# Altium schematic sheet VoltageRef.SchDoc
size A3; Author: P Shersby; SheetNumber: 1
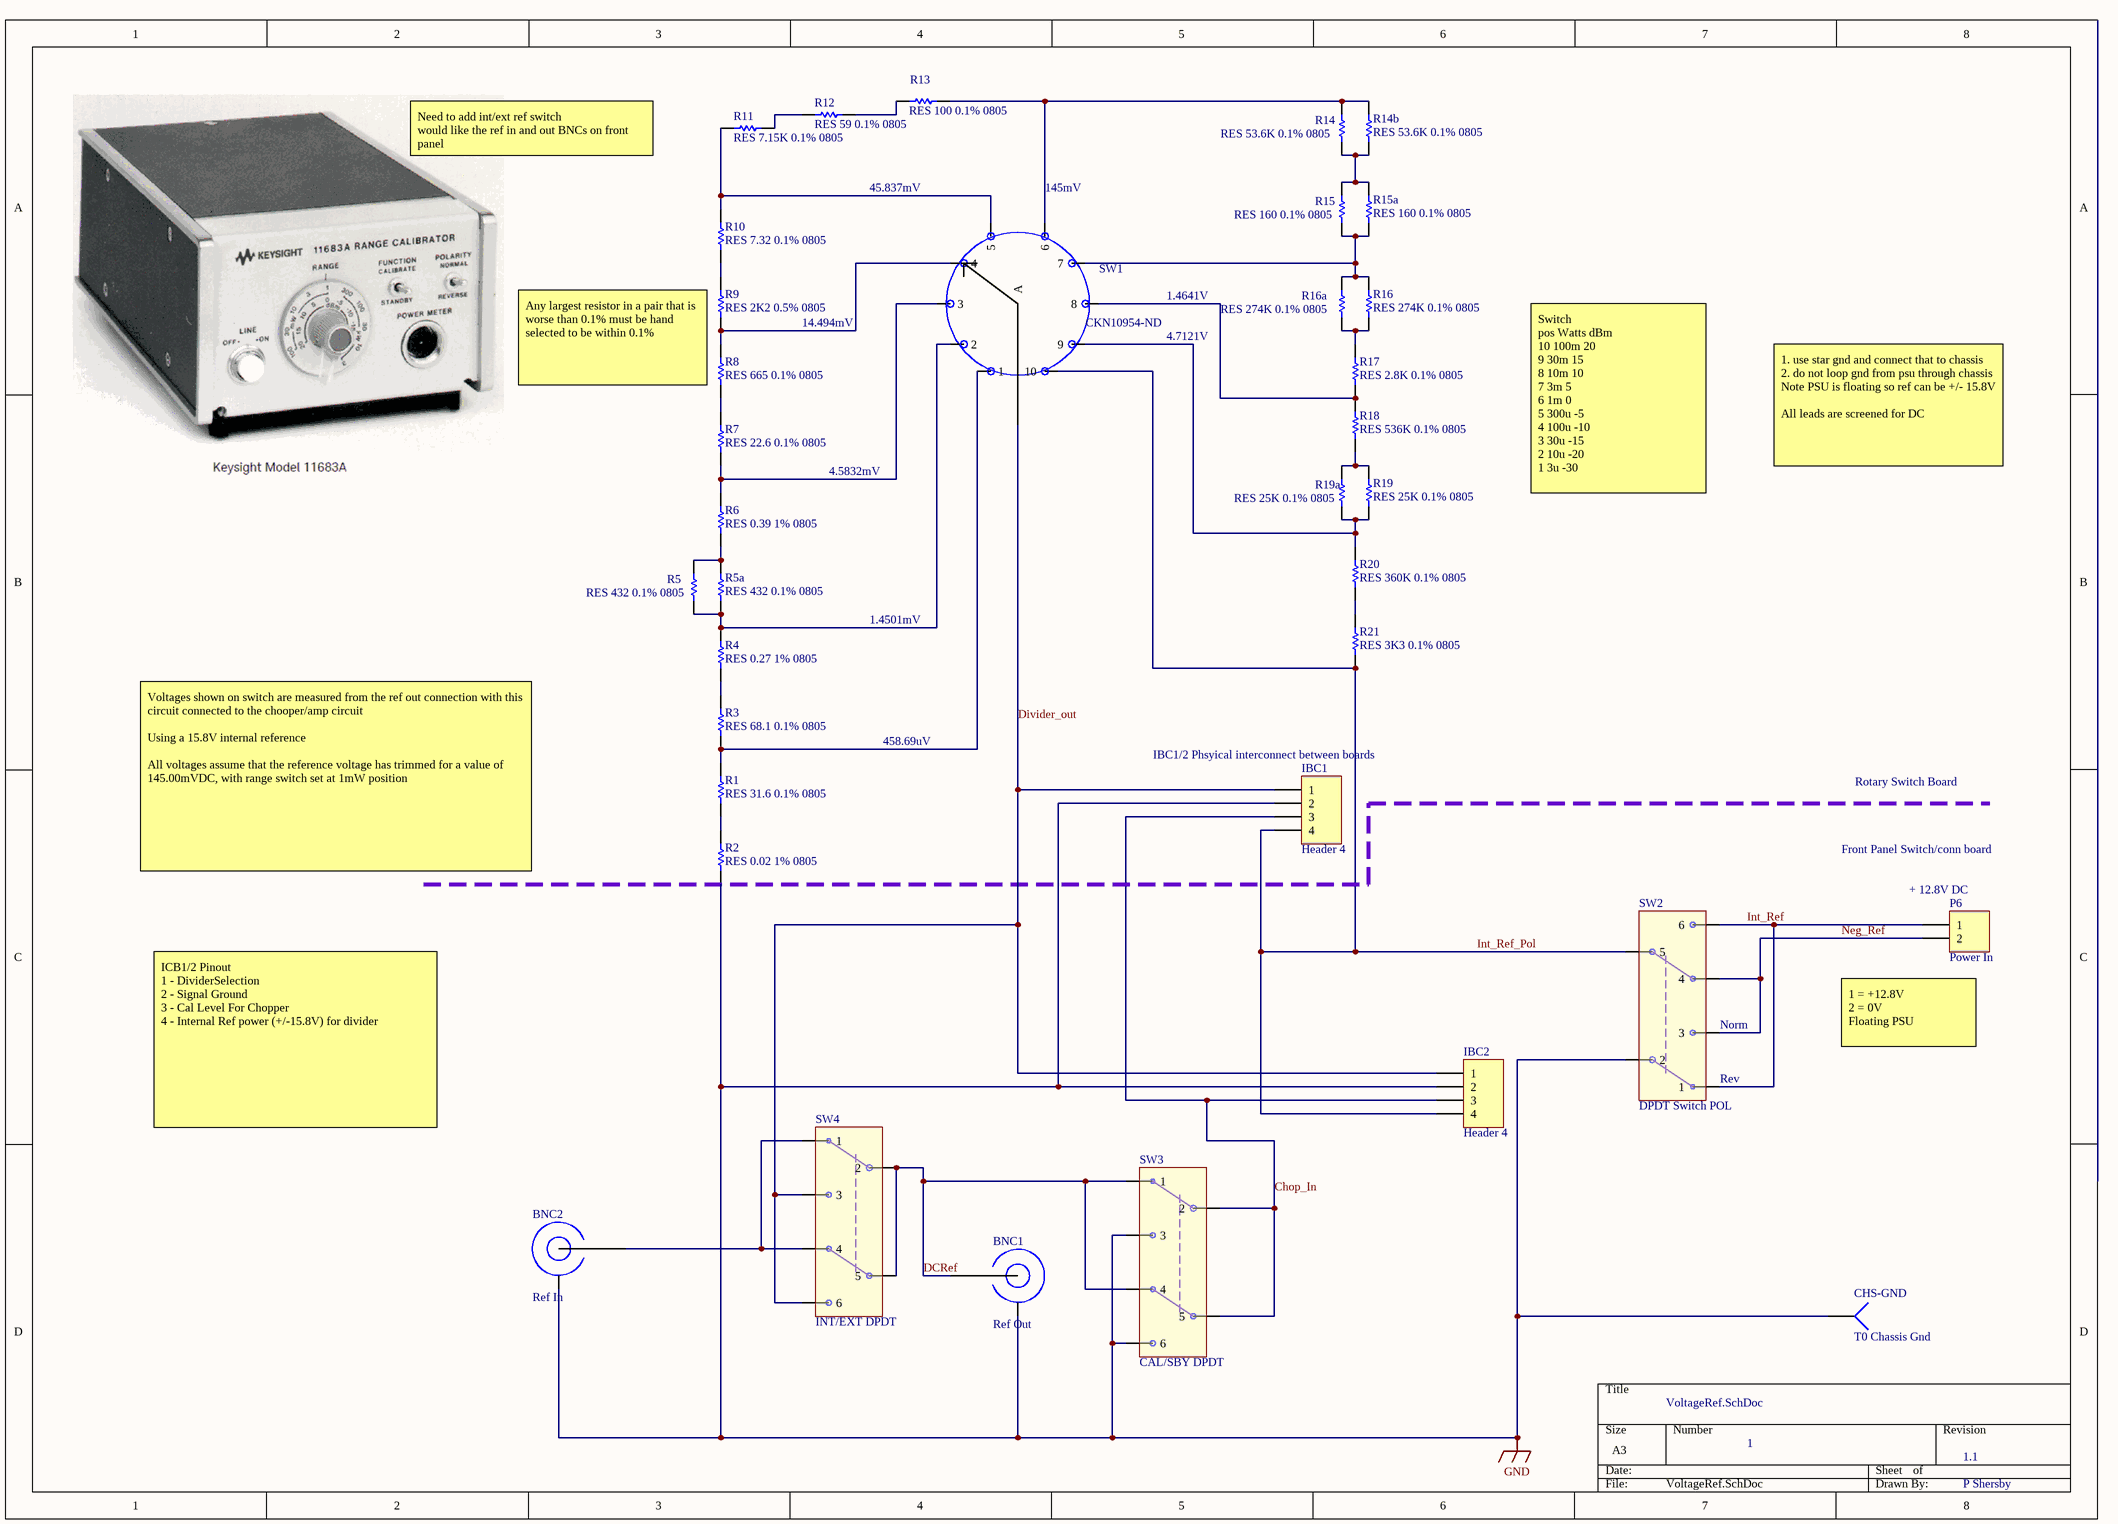
[diagram p0: VoltageRef.SchDoc]

## Parts
BNC1  Ref Out  [BNC PCB Plastic]
BNC2  Ref In  [BNC PCB Plastic]
CHS-GND  T0 Chassis Gnd  [PIN1]
IBC1  Header 4  [HDR1X4]
IBC2  Header 4  [HDR1X4]
P6  Power In  [HDR1X2]
R1  RES 31.6 0.1% 0805  [RESC2013X70X40LL20T20]
R2  RES 0.02 1% 0805  [RESC2013X70X40LL20T20]
R3  RES 68.1 0.1% 0805  [RESC2013X70X40LL20T20]
R4  RES 0.27 1% 0805  [RESC2013X70X40LL20T20]
R5  RES 432 0.1% 0805  [RESC2013X70X40LL20T20]
R5a  RES 432 0.1% 0805  [RESC2013X70X40LL20T20]
R6  RES 0.39 1% 0805  [RESC2013X70X40LL20T20]
R7  RES 22.6 0.1% 0805  [RESC2013X70X40LL20T20]
R8  RES 665 0.1% 0805  [RESC2013X70X40LL20T20]
R9  RES 2K2 0.5% 0805  [RESC2013X70X40LL20T20]
R10  RES 7.32 0.1% 0805  [RESC2013X70X40LL20T20]
R11  RES 7.15K 0.1% 0805  [RESC2013X70X40LL20T20]
R12  RES 59 0.1% 0805  [RESC2013X70X40LL20T20]
R13  RES 100 0.1% 0805  [RESC2013X70X40LL20T20]
R14  RES 53.6K 0.1% 0805  [RESC2013X70X40LL20T20]
R14b  RES 53.6K 0.1% 0805  [RESC2013X70X40LL20T20]
R15  RES 160 0.1% 0805  [RESC2013X70X40LL20T20]
R15a  RES 160 0.1% 0805  [RESC2013X70X40LL20T20]
R16  RES 274K 0.1% 0805  [RESC2013X70X40LL20T20]
R16a  RES 274K 0.1% 0805  [RESC2013X70X40LL20T20]
R17  RES 2.8K 0.1% 0805  [RESC2013X70X40LL20T20]
R18  RES 536K 0.1% 0805  [RESC2013X70X40LL20T20]
R19  RES 25K 0.1% 0805  [RESC2013X70X40LL20T20]
R19a  RES 25K 0.1% 0805  [RESC2013X70X40LL20T20]
R20  RES 360K 0.1% 0805  [RESC2013X70X40LL20T20]
R21  RES 3K3 0.1% 0805  [RESC2013X70X40LL20T20]
SW1  Part Number: CKN10954-ND  [SW_ROT_4x12]  (hidden comment: Rotary Switch 10way)
SW2  DPDT Switch POL  [DPDT Toggle E switch]
SW3  CAL/SBY DPDT  [DPDT Toggle E switch]
SW4  INT/EXT DPDT  [DPDT Toggle E switch]

## Nets
GND: BNC1.2(Gnd) BNC2.2(Gnd) CHS-GND.1 IBC1.2 IBC2.2 R2.1 SW2.2 SW3.3 SW3.6
Chop_In: IBC1.3 IBC2.3 SW3.2 SW3.5
DCRef: BNC1.1(Signal) SW3.1 SW3.4 SW4.2 SW4.5
Divider_out: IBC1.1 IBC2.1 SW1.A SW4.3 SW4.6
Int_Ref: P6.1 SW2.1 SW2.6
Int_Ref_Pol: IBC1.4 IBC2.4 R21.1 SW1.10 SW2.5
Neg_Ref: P6.2 SW2.3 SW2.4
NetBNC2_1: BNC2.1(Signal) SW4.1 SW4.4
NetR1_1: R1.1 R2.2
NetR1_2: R1.2 R3.1 SW1.1
NetR3_2: R3.2 R4.1
NetR4_2: R4.2 R5.1 R5a.1 SW1.2
NetR5_2: R5.2 R5a.2 R6.1
NetR6_2: R6.2 R7.1 SW1.3
NetR7_2: R7.2 R8.1
NetR8_2: R8.2 R9.1 SW1.4
NetR9_2: R9.2 R10.1
NetR10_2: R10.2 R11.1 SW1.5
NetR11_2: R11.2 R12.1
NetR12_2: R12.2 R13.1
NetR13_2: R13.2 R14.2 R14b.2 SW1.6
NetR14_1: R14.1 R14b.1 R15.2 R15a.2
NetR15_1: R15.1 R15a.1 R16.2 R16a.2 SW1.7
NetR16_1: R16.1 R16a.1 R17.2
NetR17_1: R17.1 R18.2 SW1.8
NetR18_1: R18.1 R19.2 R19a.2
NetR19_1: R19.1 R19a.1 R20.2 SW1.9
NetR20_1: R20.1 R21.2

## Notes on the sheet
- Need to add int/ext ref switch
  would like the ref in and out BNCs on front panel
- 45.837mV
- (near SW1) 145mV
- 14.494mV
- 1.4641V
- Any largest resistor in a pair that is worse than 0.1% must be hand selected to be within 0.1%
- 4.7121V
- 1. use star gnd and connect that to chassis
  2. do not loop gnd from psu through chassis
  Note PSU is floating so ref can be +/- 15.8V
  All leads are screened for DC
- 4.5832mV
- Switch
  pos	Watts	dBm
  10	100m	20
  9	30m	15
  8	10m	10
  7	3m	5
  6	1m	0
  5	300u	-5
  4	100u	-10
  3	30u	-15
  2	10u	-20
  1	3u	-30
- 1.4501mV
- 458.69uV
- (near IBC1) IBC1/2 Phsyical interconnect between boards
- Rotary Switch Board
- Voltages shown on switch are measured from the ref out connection with this circuit connected to the chooper/amp circuit
  Using a 15.8V internal reference
  All voltages assume that the reference voltage has trimmed for a value of 145.00mVDC, with range switch set at 1mW position
- Front Panel Switch/conn board
- (near P6) + 12.8V DC
- (near SW2) Norm
- (near P6) 1 = +12.8V
  2 = 0V
  Floating PSU
- ICB1/2 Pinout
  1 - DividerSelection
  2 - Signal Ground
  3 - Cal Level For Chopper
  4 - Internal Ref power (+/-15.8V) for divider
- (near SW2) Rev
- 1.1

## Library data of the parts
BNC1 = BNC PCB: BNC PCB Mount
BNC2 = BNC PCB: BNC Ref Out
CHS-GND = Socket: LatestRevisionDate: 17-Jul-2002; LatestRevisionNote: Re-released for DXP Platform.; Publisher: Altium Limited
IBC1 IBC2 = Header 4: Header, 4-Pin; LatestRevisionDate: 17-Jul-2002; LatestRevisionNote: Re-released for DXP Platform.; Publisher: Altium Limited
P6 = Header 2: Header, 2-Pin; LatestRevisionDate: 17-Jul-2002; LatestRevisionNote: Re-released for DXP Platform.; Publisher: Altium Limited
R1 = CMP-2001-00110-5: Resistor 31.6 0.1% 0805  0.2W 10ppm/C; Manufacturer: Panasonic; Voltage Rating: 150 V; Package Quantity: 5000; PackageDescription: 2-Pin Surface Mount Device, Body 2 x 1.25 mm; Mounting Technology: Surface Mount; ComponentLink2URL: http://industrial.panasonic.com/cdbs/www-data/pdf/RDA0000/AOA0000C86.pdf; DatasheetVersion: 04/2015; ComponentLink1URL: http://www.panasonic.com/; Mount: Surface Mount; ComponentLink1Description: Manufacturer URL; RoHSCompliant: true; PackageReference: 0805; Min Operating Temperature: -55 degC; Height: 0.6 mm; ComponentLink2Description: Datasheet; Max Operating Temperature: 155 degC; Length: 2 mm; Packaging: Tape and Reel; REACH SVHC: Yes
R2 = CMP-2001-00110-5: Resistor 0.02 1% 0805  0.5W 50ppm/C; Manufacturer: Panasonic; Voltage Rating: 150 V; Package Quantity: 5000; PackageDescription: 2-Pin Surface Mount Device, Body 2 x 1.25 mm; Mounting Technology: Surface Mount; ComponentLink2URL: http://industrial.panasonic.com/cdbs/www-data/pdf/RDA0000/AOA0000C86.pdf; DatasheetVersion: 04/2015; ComponentLink1URL: http://www.panasonic.com/; Mount: Surface Mount; ComponentLink1Description: Manufacturer URL; RoHSCompliant: true; PackageReference: 0805; Min Operating Temperature: -55 degC; Height: 0.6 mm; ComponentLink2Description: Datasheet; Max Operating Temperature: 155 degC; Length: 2 mm; Packaging: Tape and Reel; REACH SVHC: Yes
R3 = CMP-2001-00110-5: Resistor 68.1 0.1% 0805  0.2W 10ppm/C; Manufacturer: Panasonic; Voltage Rating: 150 V; Package Quantity: 5000; PackageDescription: 2-Pin Surface Mount Device, Body 2 x 1.25 mm; Mounting Technology: Surface Mount; ComponentLink2URL: http://industrial.panasonic.com/cdbs/www-data/pdf/RDA0000/AOA0000C86.pdf; DatasheetVersion: 04/2015; ComponentLink1URL: http://www.panasonic.com/; Mount: Surface Mount; ComponentLink1Description: Manufacturer URL; RoHSCompliant: true; PackageReference: 0805; Min Operating Temperature: -55 degC; Height: 0.6 mm; ComponentLink2Description: Datasheet; Max Operating Temperature: 155 degC; Length: 2 mm; Packaging: Tape and Reel; REACH SVHC: Yes
R4 = CMP-2001-00110-5: Resistor 0.27 1% 0805  0.2W 10ppm/C; Manufacturer: Panasonic; Voltage Rating: 150 V; Package Quantity: 5000; PackageDescription: 2-Pin Surface Mount Device, Body 2 x 1.25 mm; Mounting Technology: Surface Mount; ComponentLink2URL: http://industrial.panasonic.com/cdbs/www-data/pdf/RDA0000/AOA0000C86.pdf; DatasheetVersion: 04/2015; ComponentLink1URL: http://www.panasonic.com/; Mount: Surface Mount; ComponentLink1Description: Manufacturer URL; RoHSCompliant: true; PackageReference: 0805; Min Operating Temperature: -55 degC; Height: 0.6 mm; ComponentLink2Description: Datasheet; Max Operating Temperature: 155 degC; Length: 2 mm; Packaging: Tape and Reel; REACH SVHC: Yes
R5 R5a = CMP-2001-00110-5: Resistor 432 0.1% 0805  0.2W 10ppm/C; Manufacturer: Panasonic; Voltage Rating: 150 V; Package Quantity: 5000; PackageDescription: 2-Pin Surface Mount Device, Body 2 x 1.25 mm; Mounting Technology: Surface Mount; ComponentLink2URL: http://industrial.panasonic.com/cdbs/www-data/pdf/RDA0000/AOA0000C86.pdf; DatasheetVersion: 04/2015; ComponentLink1URL: http://www.panasonic.com/; Mount: Surface Mount; ComponentLink1Description: Manufacturer URL; RoHSCompliant: true; PackageReference: 0805; Min Operating Temperature: -55 degC; Height: 0.6 mm; ComponentLink2Description: Datasheet; Max Operating Temperature: 155 degC; Length: 2 mm; Packaging: Tape and Reel; REACH SVHC: Yes
R6 = CMP-2001-00110-5: Resistor 0.39 1% 0805  0.2W 10ppm/C; Manufacturer: Panasonic; Voltage Rating: 150 V; Package Quantity: 5000; PackageDescription: 2-Pin Surface Mount Device, Body 2 x 1.25 mm; Mounting Technology: Surface Mount; ComponentLink2URL: http://industrial.panasonic.com/cdbs/www-data/pdf/RDA0000/AOA0000C86.pdf; DatasheetVersion: 04/2015; ComponentLink1URL: http://www.panasonic.com/; Mount: Surface Mount; ComponentLink1Description: Manufacturer URL; RoHSCompliant: true; PackageReference: 0805; Min Operating Temperature: -55 degC; Height: 0.6 mm; ComponentLink2Description: Datasheet; Max Operating Temperature: 155 degC; Length: 2 mm; Packaging: Tape and Reel; REACH SVHC: Yes
R7 = CMP-2001-00110-5: Resistor 22.6 0.1% 0805  0.2W 10ppm/C; Manufacturer: Panasonic; Voltage Rating: 150 V; Package Quantity: 5000; PackageDescription: 2-Pin Surface Mount Device, Body 2 x 1.25 mm; Mounting Technology: Surface Mount; ComponentLink2URL: http://industrial.panasonic.com/cdbs/www-data/pdf/RDA0000/AOA0000C86.pdf; DatasheetVersion: 04/2015; ComponentLink1URL: http://www.panasonic.com/; Mount: Surface Mount; ComponentLink1Description: Manufacturer URL; RoHSCompliant: true; PackageReference: 0805; Min Operating Temperature: -55 degC; Height: 0.6 mm; ComponentLink2Description: Datasheet; Max Operating Temperature: 155 degC; Length: 2 mm; Packaging: Tape and Reel; REACH SVHC: Yes
R8 = CMP-2001-00110-5: Resistor 665 0.1% 0805  0.2W 10ppm/C; Manufacturer: Panasonic; Voltage Rating: 150 V; Package Quantity: 5000; PackageDescription: 2-Pin Surface Mount Device, Body 2 x 1.25 mm; Mounting Technology: Surface Mount; ComponentLink2URL: http://industrial.panasonic.com/cdbs/www-data/pdf/RDA0000/AOA0000C86.pdf; DatasheetVersion: 04/2015; ComponentLink1URL: http://www.panasonic.com/; Mount: Surface Mount; ComponentLink1Description: Manufacturer URL; RoHSCompliant: true; PackageReference: 0805; Min Operating Temperature: -55 degC; Height: 0.6 mm; ComponentLink2Description: Datasheet; Max Operating Temperature: 155 degC; Length: 2 mm; Packaging: Tape and Reel; REACH SVHC: Yes
R9 = CMP-2001-00110-5: Resistor 2K2 0.5%  0805  0.2W 10ppm/C; Manufacturer: Panasonic; Voltage Rating: 150 V; Package Quantity: 5000; PackageDescription: 2-Pin Surface Mount Device, Body 2 x 1.25 mm; Mounting Technology: Surface Mount; ComponentLink2URL: http://industrial.panasonic.com/cdbs/www-data/pdf/RDA0000/AOA0000C86.pdf; DatasheetVersion: 04/2015; ComponentLink1URL: http://www.panasonic.com/; Mount: Surface Mount; ComponentLink1Description: Manufacturer URL; RoHSCompliant: true; PackageReference: 0805; Min Operating Temperature: -55 degC; Height: 0.6 mm; ComponentLink2Description: Datasheet; Max Operating Temperature: 155 degC; Length: 2 mm; Packaging: Tape and Reel; REACH SVHC: Yes
R10 = CMP-2001-00110-5: Resistor 7.32 0.1% 0805  0.2W 10ppm/C; Manufacturer: Panasonic; Voltage Rating: 150 V; Package Quantity: 5000; PackageDescription: 2-Pin Surface Mount Device, Body 2 x 1.25 mm; Mounting Technology: Surface Mount; ComponentLink2URL: http://industrial.panasonic.com/cdbs/www-data/pdf/RDA0000/AOA0000C86.pdf; DatasheetVersion: 04/2015; ComponentLink1URL: http://www.panasonic.com/; Mount: Surface Mount; ComponentLink1Description: Manufacturer URL; RoHSCompliant: true; PackageReference: 0805; Min Operating Temperature: -55 degC; Height: 0.6 mm; ComponentLink2Description: Datasheet; Max Operating Temperature: 155 degC; Length: 2 mm; Packaging: Tape and Reel; REACH SVHC: Yes
R11 = CMP-2001-00110-5: Resistor 7.15K 0.1% 0805  0.2W 10ppm/C; Manufacturer: Panasonic; Voltage Rating: 150 V; Package Quantity: 5000; PackageDescription: 2-Pin Surface Mount Device, Body 2 x 1.25 mm; Mounting Technology: Surface Mount; ComponentLink2URL: http://industrial.panasonic.com/cdbs/www-data/pdf/RDA0000/AOA0000C86.pdf; DatasheetVersion: 04/2015; ComponentLink1URL: http://www.panasonic.com/; Mount: Surface Mount; ComponentLink1Description: Manufacturer URL; RoHSCompliant: true; PackageReference: 0805; Min Operating Temperature: -55 degC; Height: 0.6 mm; ComponentLink2Description: Datasheet; Max Operating Temperature: 155 degC; Length: 2 mm; Packaging: Tape and Reel; REACH SVHC: Yes
R12 = CMP-2001-00110-5: Resistor 59 0.1% 0805  0.2W 10ppm/C; Manufacturer: Panasonic; Voltage Rating: 150 V; Package Quantity: 5000; PackageDescription: 2-Pin Surface Mount Device, Body 2 x 1.25 mm; Mounting Technology: Surface Mount; ComponentLink2URL: http://industrial.panasonic.com/cdbs/www-data/pdf/RDA0000/AOA0000C86.pdf; DatasheetVersion: 04/2015; ComponentLink1URL: http://www.panasonic.com/; Mount: Surface Mount; ComponentLink1Description: Manufacturer URL; RoHSCompliant: true; PackageReference: 0805; Min Operating Temperature: -55 degC; Height: 0.6 mm; ComponentLink2Description: Datasheet; Max Operating Temperature: 155 degC; Length: 2 mm; Packaging: Tape and Reel; REACH SVHC: Yes
R13 = CMP-2001-00110-5: Resistor 100 0.1% 0805  0.2W 10ppm/C; Manufacturer: Panasonic; Voltage Rating: 150 V; Package Quantity: 5000; PackageDescription: 2-Pin Surface Mount Device, Body 2 x 1.25 mm; Mounting Technology: Surface Mount; ComponentLink2URL: http://industrial.panasonic.com/cdbs/www-data/pdf/RDA0000/AOA0000C86.pdf; DatasheetVersion: 04/2015; ComponentLink1URL: http://www.panasonic.com/; Mount: Surface Mount; ComponentLink1Description: Manufacturer URL; RoHSCompliant: true; PackageReference: 0805; Min Operating Temperature: -55 degC; Height: 0.6 mm; ComponentLink2Description: Datasheet; Max Operating Temperature: 155 degC; Length: 2 mm; Packaging: Tape and Reel; REACH SVHC: Yes
R14 R14b = CMP-2001-00110-5: Resistor 53.6K 0.1% 0805  0.2W 10ppm/C; Manufacturer: Panasonic; Voltage Rating: 150 V; Package Quantity: 5000; PackageDescription: 2-Pin Surface Mount Device, Body 2 x 1.25 mm; Mounting Technology: Surface Mount; ComponentLink2URL: http://industrial.panasonic.com/cdbs/www-data/pdf/RDA0000/AOA0000C86.pdf; DatasheetVersion: 04/2015; ComponentLink1URL: http://www.panasonic.com/; Mount: Surface Mount; ComponentLink1Description: Manufacturer URL; RoHSCompliant: true; PackageReference: 0805; Min Operating Temperature: -55 degC; Height: 0.6 mm; ComponentLink2Description: Datasheet; Max Operating Temperature: 155 degC; Length: 2 mm; Packaging: Tape and Reel; REACH SVHC: Yes
R15 R15a = CMP-2001-00110-5: Resistor 160 0.1% 0805  0.2W 10ppm/C; Manufacturer: Panasonic; Voltage Rating: 150 V; Package Quantity: 5000; PackageDescription: 2-Pin Surface Mount Device, Body 2 x 1.25 mm; Mounting Technology: Surface Mount; ComponentLink2URL: http://industrial.panasonic.com/cdbs/www-data/pdf/RDA0000/AOA0000C86.pdf; DatasheetVersion: 04/2015; ComponentLink1URL: http://www.panasonic.com/; Mount: Surface Mount; ComponentLink1Description: Manufacturer URL; RoHSCompliant: true; PackageReference: 0805; Min Operating Temperature: -55 degC; Height: 0.6 mm; ComponentLink2Description: Datasheet; Max Operating Temperature: 155 degC; Length: 2 mm; Packaging: Tape and Reel; REACH SVHC: Yes
R16 R16a = CMP-2001-00110-5: Resistor 274K 0.1% 0805  0.2W 10ppm/C; Manufacturer: Panasonic; Voltage Rating: 150 V; Package Quantity: 5000; PackageDescription: 2-Pin Surface Mount Device, Body 2 x 1.25 mm; Mounting Technology: Surface Mount; ComponentLink2URL: http://industrial.panasonic.com/cdbs/www-data/pdf/RDA0000/AOA0000C86.pdf; DatasheetVersion: 04/2015; ComponentLink1URL: http://www.panasonic.com/; Mount: Surface Mount; ComponentLink1Description: Manufacturer URL; RoHSCompliant: true; PackageReference: 0805; Min Operating Temperature: -55 degC; Height: 0.6 mm; ComponentLink2Description: Datasheet; Max Operating Temperature: 155 degC; Length: 2 mm; Packaging: Tape and Reel; REACH SVHC: Yes
R17 = CMP-2001-00110-5: Resistor 2.8K 0.1% 0805  0.2W 10ppm/C; Manufacturer: Panasonic; Voltage Rating: 150 V; Package Quantity: 5000; PackageDescription: 2-Pin Surface Mount Device, Body 2 x 1.25 mm; Mounting Technology: Surface Mount; ComponentLink2URL: http://industrial.panasonic.com/cdbs/www-data/pdf/RDA0000/AOA0000C86.pdf; DatasheetVersion: 04/2015; ComponentLink1URL: http://www.panasonic.com/; Mount: Surface Mount; ComponentLink1Description: Manufacturer URL; RoHSCompliant: true; PackageReference: 0805; Min Operating Temperature: -55 degC; Height: 0.6 mm; ComponentLink2Description: Datasheet; Max Operating Temperature: 155 degC; Length: 2 mm; Packaging: Tape and Reel; REACH SVHC: Yes
R18 = CMP-2001-00110-5: Resistor 536K 0.1% 0805  1/8W 10ppm/C; Manufacturer: Panasonic; Voltage Rating: 150 V; Package Quantity: 5000; PackageDescription: 2-Pin Surface Mount Device, Body 2 x 1.25 mm; Mounting Technology: Surface Mount; ComponentLink2URL: http://industrial.panasonic.com/cdbs/www-data/pdf/RDA0000/AOA0000C86.pdf; DatasheetVersion: 04/2015; ComponentLink1URL: http://www.panasonic.com/; Mount: Surface Mount; ComponentLink1Description: Manufacturer URL; RoHSCompliant: true; PackageReference: 0805; Min Operating Temperature: -55 degC; Height: 0.6 mm; ComponentLink2Description: Datasheet; Max Operating Temperature: 155 degC; Length: 2 mm; Packaging: Tape and Reel; REACH SVHC: Yes
R19 R19a = CMP-2001-00110-5: Resistor 25K 0.1% 0805  0.1W 10ppm/C; Manufacturer: Panasonic; Voltage Rating: 150 V; Package Quantity: 5000; PackageDescription: 2-Pin Surface Mount Device, Body 2 x 1.25 mm; Mounting Technology: Surface Mount; ComponentLink2URL: http://industrial.panasonic.com/cdbs/www-data/pdf/RDA0000/AOA0000C86.pdf; DatasheetVersion: 04/2015; ComponentLink1URL: http://www.panasonic.com/; Mount: Surface Mount; ComponentLink1Description: Manufacturer URL; RoHSCompliant: true; PackageReference: 0805; Min Operating Temperature: -55 degC; Height: 0.6 mm; ComponentLink2Description: Datasheet; Max Operating Temperature: 155 degC; Length: 2 mm; Packaging: Tape and Reel; REACH SVHC: Yes
R20 = CMP-2001-00110-5: Resistor 360K 0.1% 0805  1/8W 10ppm/C; Manufacturer: Panasonic; Voltage Rating: 150 V; Package Quantity: 5000; PackageDescription: 2-Pin Surface Mount Device, Body 2 x 1.25 mm; Mounting Technology: Surface Mount; ComponentLink2URL: http://industrial.panasonic.com/cdbs/www-data/pdf/RDA0000/AOA0000C86.pdf; DatasheetVersion: 04/2015; ComponentLink1URL: http://www.panasonic.com/; Mount: Surface Mount; ComponentLink1Description: Manufacturer URL; RoHSCompliant: true; PackageReference: 0805; Min Operating Temperature: -55 degC; Height: 0.6 mm; ComponentLink2Description: Datasheet; Max Operating Temperature: 155 degC; Length: 2 mm; Packaging: Tape and Reel; REACH SVHC: Yes
R21 = CMP-2001-00110-5: Resistor 3K3 0.1% 0805  0.2W 10ppm/C; Manufacturer: Panasonic; Voltage Rating: 150 V; Package Quantity: 5000; PackageDescription: 2-Pin Surface Mount Device, Body 2 x 1.25 mm; Mounting Technology: Surface Mount; ComponentLink2URL: http://industrial.panasonic.com/cdbs/www-data/pdf/RDA0000/AOA0000C86.pdf; DatasheetVersion: 04/2015; ComponentLink1URL: http://www.panasonic.com/; Mount: Surface Mount; ComponentLink1Description: Manufacturer URL; RoHSCompliant: true; PackageReference: 0805; Min Operating Temperature: -55 degC; Height: 0.6 mm; ComponentLink2Description: Datasheet; Max Operating Temperature: 155 degC; Length: 2 mm; Packaging: Tape and Reel; REACH SVHC: Yes
SW1 = Rotary_Switch_1x10: Rotary Switch 10way PCB CKN10954-ND
SW2 SW4 = DPDT Switch
SW3 = DPDT Switch: CAL/SDBY DPDT